# EAGLE design Xbee_Shield_V01 (EAGLE 8.3.2)
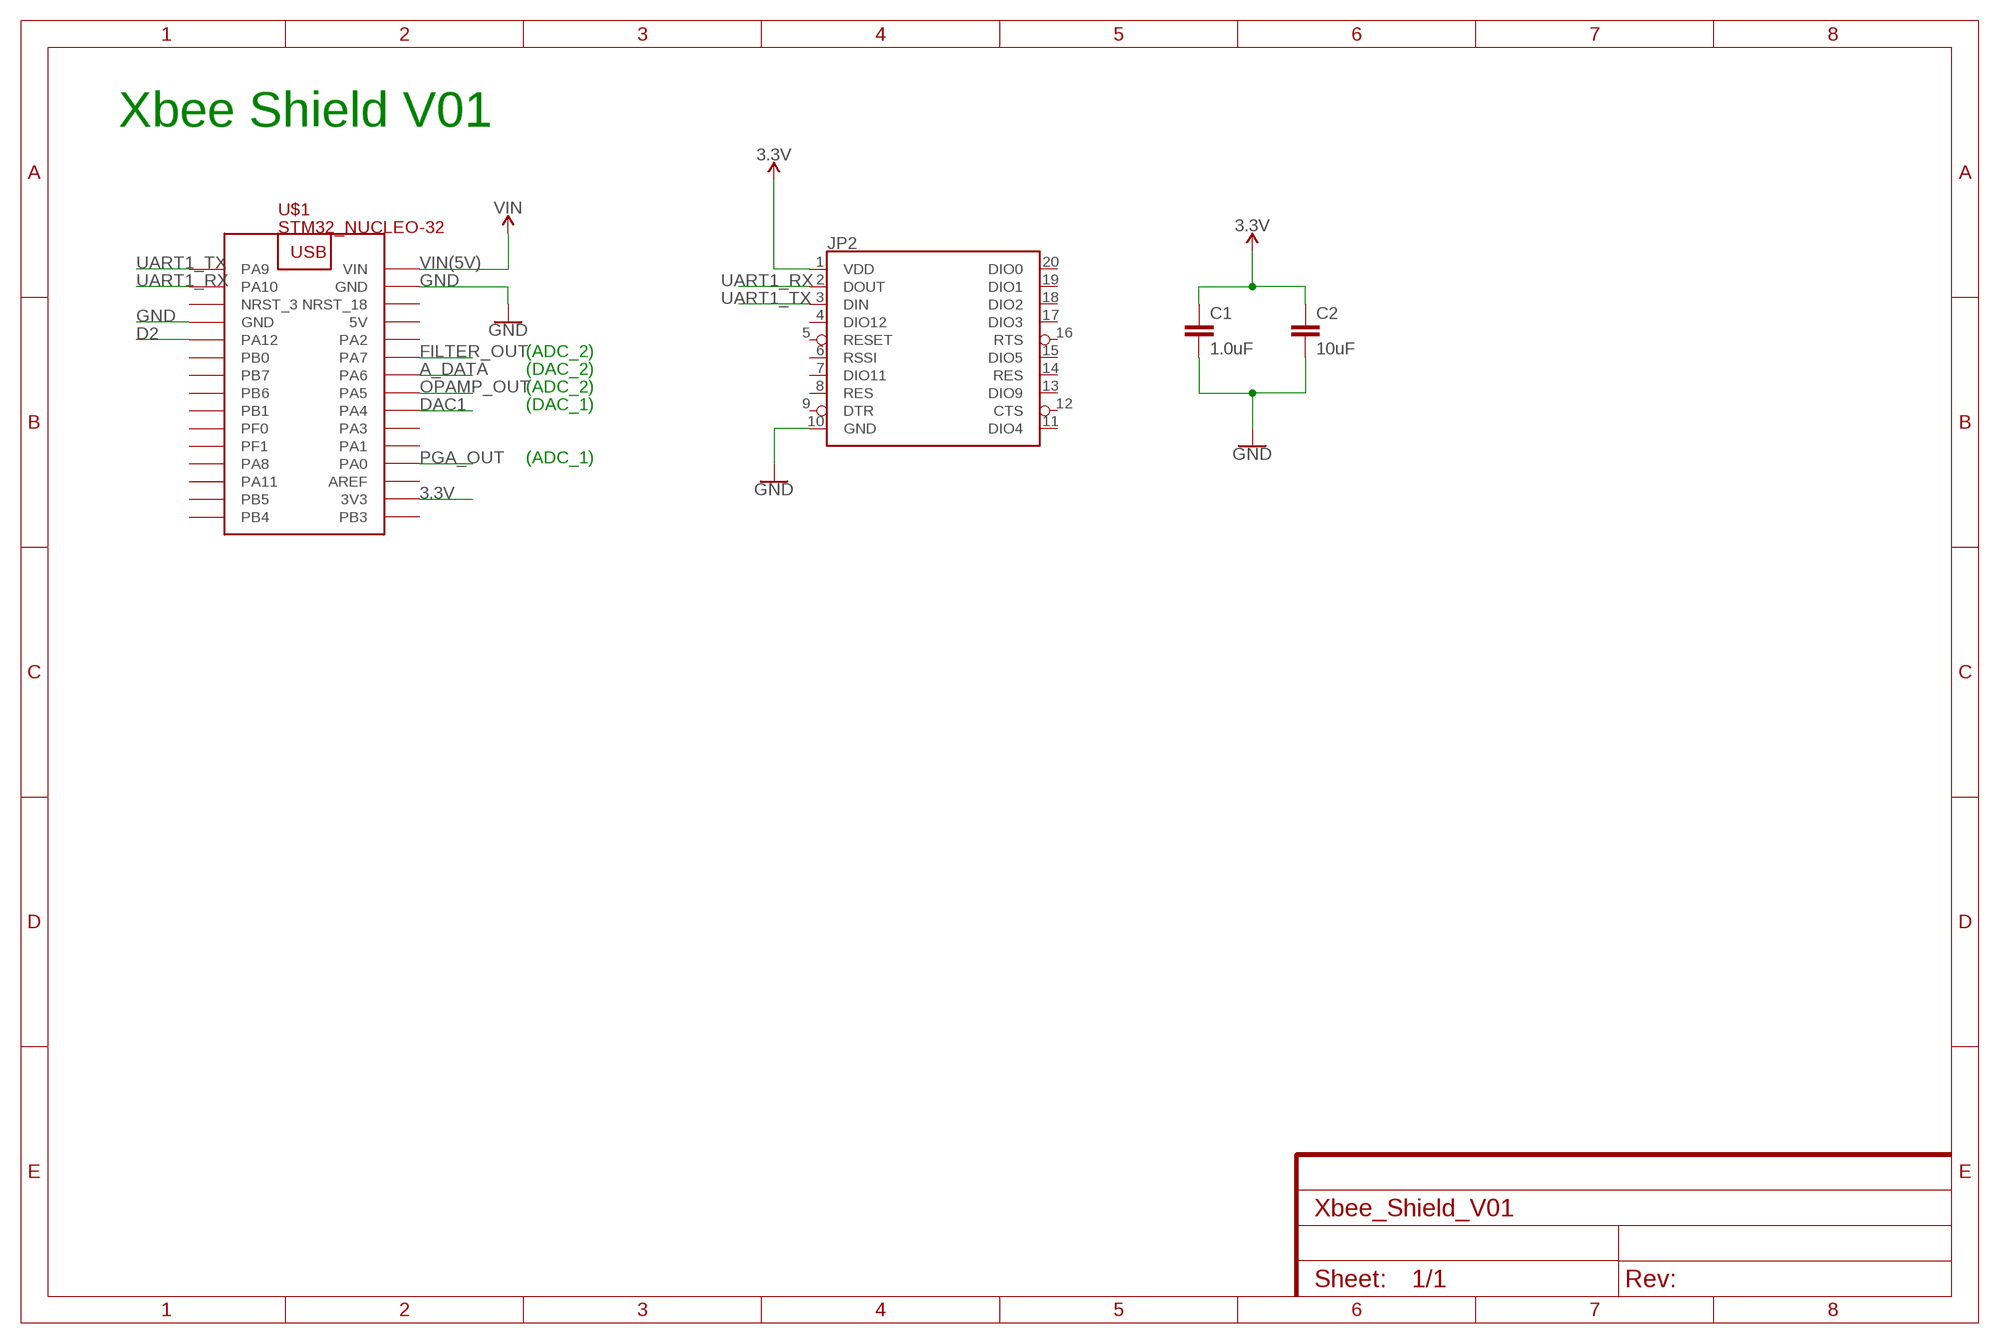
[diagram p0: schematic, sheet 1]

## Parts
C1  1.0uF  1.0UF-0805-25V-10%  [0805]
C2  10uF  1.0UF-0805-25V-10%  [0805]
JP2  XBEESILK  [XBEE-SILK]
U$1  STM32_NUCLEO-32  [STM32_NUCLEO-32]

## Nets
3.3V: C1.1 C2.1 JP2.1(VDD) U$1.3V3
A_DATA: U$1.PA6
D2: U$1.PA12
DAC1: U$1.PA4
FILTER_OUT: U$1.PA7
GND: C1.2 C2.2 JP2.10(GND) U$1.GND@4(GND) U$1.GND@17(GND)
OPAMP_OUT: U$1.PA5
PGA_OUT: U$1.PA0
UART1_RX: JP2.2(DOUT) U$1.PA10
UART1_TX: JP2.3(DIN) U$1.PA9
VIN(5V): U$1.VIN ; supply symbol labelled VIN
Unconnected: JP2.4(DIO12) JP2.5(RESET) JP2.6(RSSI) JP2.7(DIO11) JP2.8(RES) JP2.9(DTR) JP2.11(DIO4) JP2.12(CTS) JP2.13(DIO9) JP2.14(RES) JP2.15(DIO5) JP2.16(RTS) JP2.17(DIO3) JP2.18(DIO2) JP2.19(DIO1) JP2.20(DIO0) U$1.AREF U$1.NRST_3 U$1.NRST_18 U$1.PA1 U$1.PA2 U$1.PA3 U$1.PA8 U$1.PA11 U$1.PB0 U$1.PB1 U$1.PB3 U$1.PB4 U$1.PB5 U$1.PB6 U$1.PB7 U$1.PF0 U$1.PF1

## Notes on the sheet
- Xbee Shield V01
- (ADC_2)
- (DAC_2)
- (ADC_2)
- (DAC_1)
- (ADC_1)

## Power pins joined to a net without a drawn wire
5V: U$1.5V

## Library data of the parts
C1 = SparkFun-Capacitors:1.0UF: 1µF ceramic capacitors A capacitor is a passive two-terminal electrical component used to store electrical energy temporarily in an electric field.; PROD_ID: CAP-08064
C2 = SparkFun-Capacitors:1.0UF: 1µF ceramic capacitors A capacitor is a passive two-terminal electrical component used to store electrical energy temporarily in an electric field.; PROD_ID: CAP-08064; VALUE: 1.0uF
JP2 = SparkFun-RF:XBEE: Digi XBee and XBee Pro XBees are tiny blue chips that can communicate wirelessly with each other. They can do simple things, like replacing a couple of wires in serial communication, which is nice when you want to make a remote for your paintball vehicle. SparkFun Products SparkFun XBee Buying Guide <https://www.sparkfun.com/pages/xbee_guide> SparkFun XBee Explorer USB <https://www.sparkfun.com/products/11812> (WRL-11812) Breakout Board for XBee Module <https://www.sparkfun.com/products/8276> (WRL-8276) SparkFun XBee Explorer Regulated <https://www.sparkfun.com/products/11373> (WRL-11373) SparkFun XBee Explorer Dongle <https://www.sparkfun.com/products/11697> (WRL-11697) SparkFun XBee Shield <https://www.sparkfun.com/products/12847> (WRL-12847) SparkFun XBee Explorer Serial <https://www.sparkfun.com/products/13225> (WRL-13225)
U$1 = Stm32_Nucleo-32:STM32_NUCLEO-32: STM32_NUCLEO-32

## Net classes
0 default: width 0.254 mm, drill 0.4 mm, clearance 0.203 mm

## Board
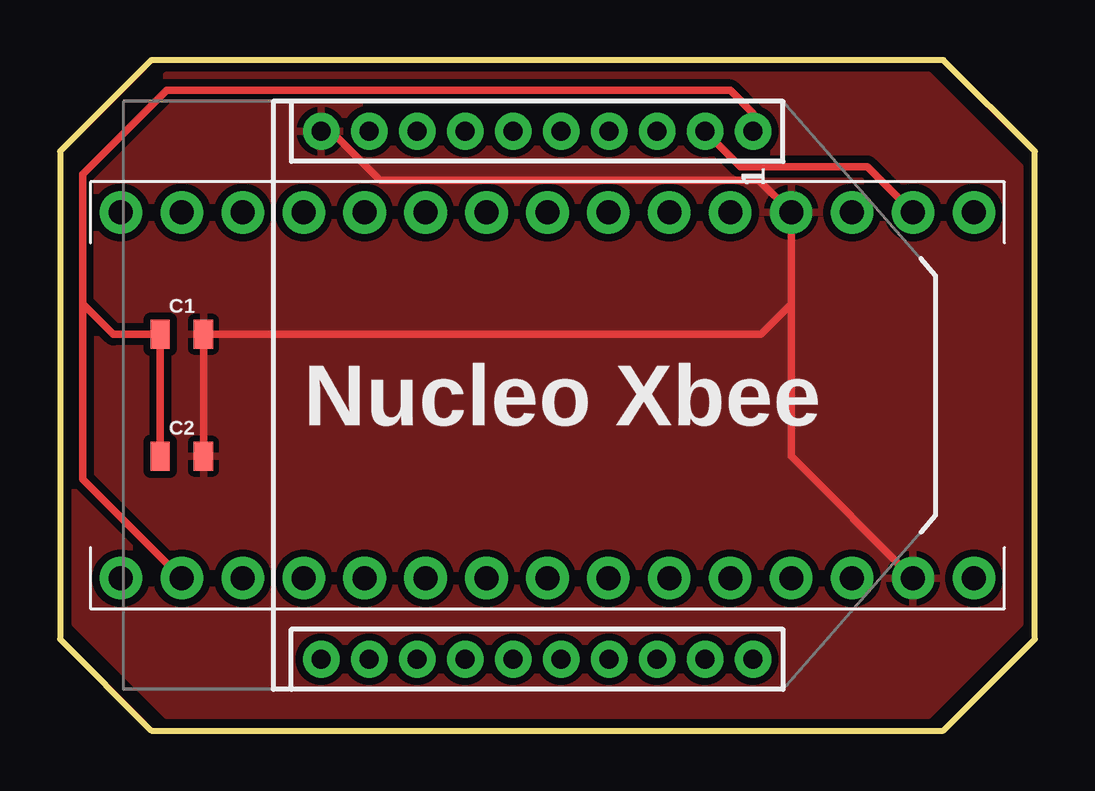
[diagram p1: board, top side]
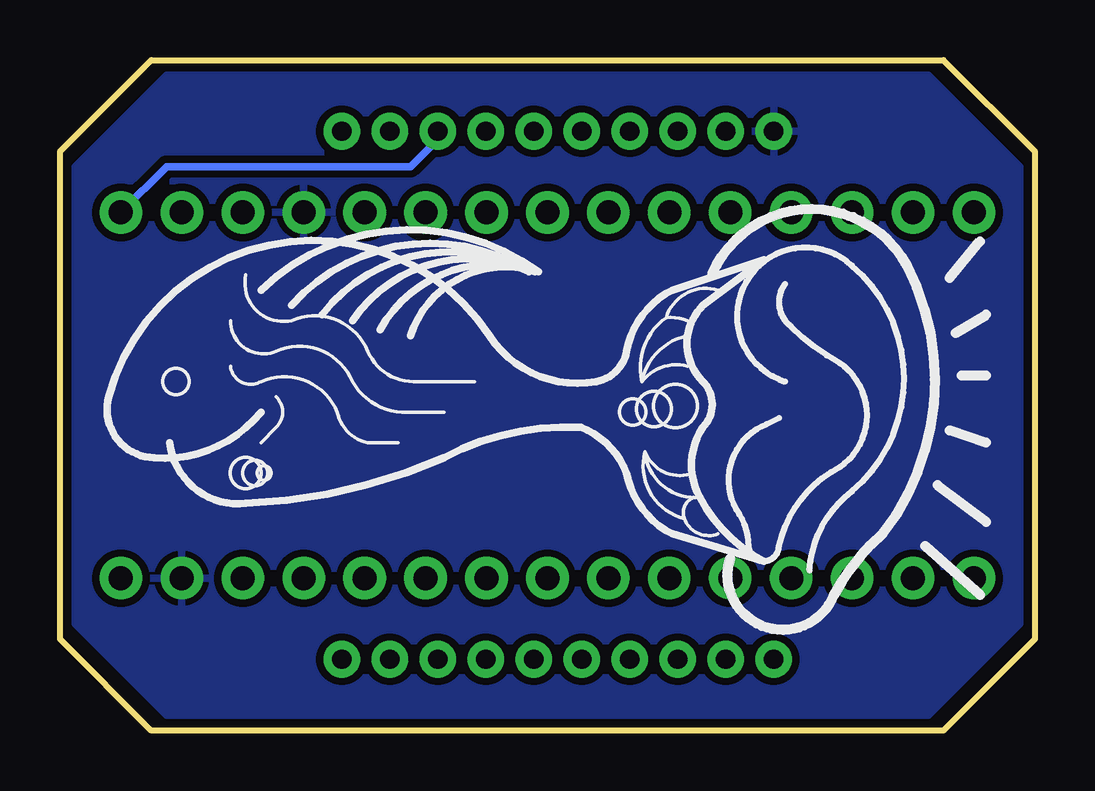
[diagram p2: board, bottom side, seen from below]

Size 40.64 x 27.94 mm. Coordinates in mm from the lower left corner, seen from the top.
Outline: 40.64,3.81 40.64,24.13 36.83,27.94 3.81,27.94 0,24.13 0,3.81 3.81,0 36.83,0 40.64,3.81
Copper layers (1*16): Top 0.035mm / dielectric 1.5mm / Bottom 0.035mm
Design rules "Modified-SparkFun-2-layer-STANDARD": minimum track width 10mil, minimum drill 15mil, track to track 10mil, track to pad 8mil, pad to pad 8mil, via to via 10mil, smd to smd 8mil, copper to edge 8mil, drill to drill 8mil, minimum pad ring 10mil, minimum via ring 10mil, stop-mask expansion 4mil, vias tented up to drill 25mil, thermal gap 10mil

### Footprints (pad centres in the part's own frame; a part is rotated, then mirrored left to right if it is on the bottom)
0805 = smd 0.8 x 1.2: 1 -0.9,0; 2 0.9,0
XBEE-SILK = drill 0.8 pad 1.524: 1 -11,20; 2 -11,18; 3 -11,16; 4 -11,14; 5 -11,12; 6 -11,10; 7 -11,8; 8 -11,6; 9 -11,4; 10 -11,2; 11 11,2; 12 11,4; 13 11,6; 14 11,8; 15 11,10; 16 11,12; 17 11,14; 18 11,16; 19 11,18; 20 11,20
STM32_NUCLEO-32 = drill 1 pad 1.778: 3V3 16.51,3.81; 5V 16.51,29.21; AREF 16.51,6.35; GND@4 1.27,29.21; GND@17 16.51,34.29; NRST_3 1.27,31.75; NRST_18 16.51,31.75; PA0 16.51,8.89; PA1 16.51,11.43; PA2 16.51,26.67; PA3 16.51,13.97; PA4 16.51,16.51; PA5 16.51,19.05; PA6 16.51,21.59; PA7 16.51,24.13; PA8 1.27,8.89; PA9 1.27,36.83; PA10 1.27,34.29; PA11 1.27,6.35; PA12 1.27,26.67; PB0 1.27,24.13; PB1 1.27,16.51; PB3 16.51,1.27; PB4 1.27,1.27; PB5 1.27,3.81; PB6 1.27,19.05; PB7 1.27,21.59; PF0 1.27,13.97; PF1 1.27,11.43; VIN 16.51,36.83

### Placement (x,y rotation side)
C1  5.08,16.51 0 top
C2  5.08,11.43 0 top
JP2  8.89,13.97 270 top
U$1  1.27,22.86 270 top

### Tracks (layer width: path | path; a pad name or v marks a point on that pad's centre or on a via)
3.3V
  Top 0.305: JP2.1 28.89,25.72 27.94,26.67 4.45,26.67 0.95,23.18 0.95,17.78 | 0.95,17.78 0.95,10.48 U$1.3V3 | C2.1 C1.1 2.22,16.51 0.95,17.78
GND
  Top 0.305: JP2.10 11.31,24.97 13.34,22.94 29.13,22.94 U$1.GND@4 30.48,17.78 | 30.48,17.78 30.48,11.43 U$1.GND@17 | C2.2 C1.2 29.21,16.51 30.48,17.78
  pour Top (isolate 0.305): 4.45,0.64 36.2,0.64 40.01,4.45 40.01,23.5 36.2,27.3 4.45,27.3 0.64,23.5 0.64,4.45
  pour Bottom (isolate 0.305): 36.2,27.3 4.45,27.3 0.64,23.5 0.64,4.45 4.45,0.64 36.2,0.64 40.01,4.45 40.01,23.5
UART1_RX
  Top 0.305: U$1.PA10 33.66,23.5 28.36,23.5 JP2.2
UART1_TX
  Bottom 0.305: JP2.3 24.89,24.64 26.04,23.5 36.2,23.5 U$1.PA9

### Text on the board
tPlace: Nucleo Xbee